# EAGLE design rpifan (EAGLE 9.6.1)
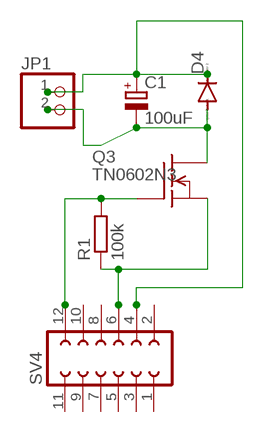
[diagram p0: schematic, sheet 1]

## Parts
C1  100uF  CPOL-EUE2-5  [E2-5]
D4  DIODE-D-2.5  [D-2.5]
JP1  PINHD-1X2  [1X02]
Q3  TN0602N3  [TO-92]
R1  100k  R-EU_0204/7  [0204/7]
SV4  FE06-2  [FE06-2]

## Nets
N$1: Q3.2(G) R1.2 SV4.12
N$2: Q3.1(S) R1.1 SV4.6
N$3: C1.- D4.A JP1.2 Q3.3(D)
N$5: C1.+ D4.C JP1.1 SV4.4
Unconnected: SV4.1 SV4.2 SV4.3 SV4.5 SV4.7 SV4.8 SV4.9 SV4.10 SV4.11

## Library data of the parts
C1 = rcl:CPOL-EU: POLARIZED CAPACITOR, European symbol; SPICEPREFIX: C
D4 = diode:DIODE-: DIODE
JP1 = pinhead:PINHD-1X2: PIN HEADER
Q3 = transistor-fet:TN0602N3: N-Channel Enhancement MOSFET 20V; 4A; 0,75Ohm
R1 = rcl:R-EU_: RESISTOR, European symbol; SPICEPREFIX: R
SV4 = con-lsta:FE06-2: FEMALE HEADER; OC_FARNELL: unknown; OC_NEWARK: unknown

## Board
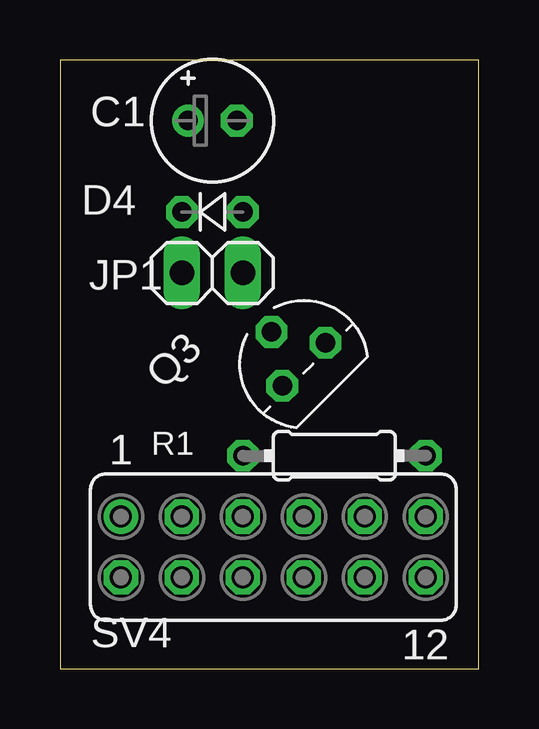
[diagram p1: board, top side]
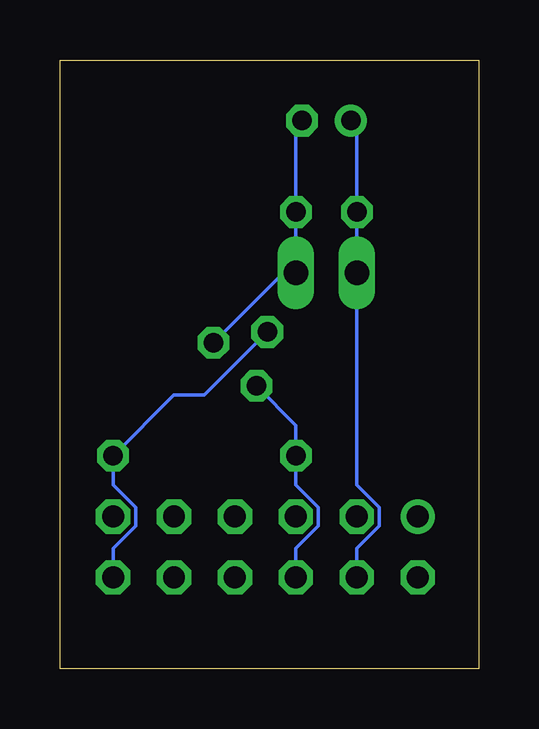
[diagram p2: board, bottom side, seen from below]

Size 17.45 x 25.39 mm. Coordinates in mm from the lower left corner, seen from the top.
Outline: 0,0 17.45,0 17.45,25.39 0,25.39 0,0
Copper layers (1*16): Top 0.035mm / dielectric 1.5mm / Bottom 0.035mm
Design rules "default": minimum track width 6mil, minimum drill 0.35mm, track to track 6mil, track to pad 6mil, pad to pad 6mil, via to via 6mil, smd to smd 6mil, copper to edge 40mil, drill to drill 6mil, minimum pad ring 10mil, minimum via ring 8mil, stop-mask expansion 4mil, vias tented up to drill 0mil, thermal gap 10mil

### Footprints (pad centres in the part's own frame; a part is rotated, then mirrored left to right if it is on the bottom)
E2-5 = drill 0.813 pad 1.27: + -1.016,0 | drill 0.813 pad 1.27 octagon: - 1.016,0
D-2.5 = drill 0.813 octagon: A 1.27,0; C -1.27,0
1X02 = drill 1.016 long: 1 -1.27,0; 2 1.27,0
TO-92 = drill 0.813 octagon: 1 -1.27,0; 2 0,1.905; 3 1.27,0
0204/7 = drill 0.813 octagon: 1 -3.81,0; 2 3.81,0
FE06-2 = drill 0.914: 1 -6.35,1.27 | drill 0.914 octagon: 2 -6.35,-1.27; 3 -3.81,1.27; 4 -3.81,-1.27; 5 -1.27,1.27; 6 -1.27,-1.27; 7 1.27,1.27; 8 1.27,-1.27; 9 3.81,1.27; 10 3.81,-1.27; 11 6.35,1.27; 12 6.35,-1.27

### Placement (x,y rotation side)
C1  6.35,22.86 0 top
D4  6.35,19.05 0 top
JP1  6.35,16.51 0 top
Q3  10.16,12.7 45 top
R1  11.43,8.89 0 top
SV4  8.89,5.08 0 top

### Tracks (layer width: path | path; a pad name or v marks a point on that pad's centre or on a via)
N$1
  Bottom 0.152: SV4.12 15.24,5.02 14.3,5.96 14.3,6.74 15.24,7.68 R1.2 12.7,11.43 11.43,11.43 Q3.2
N$2
  Bottom 0.152: SV4.6 7.62,5.02 6.68,5.96 6.68,6.74 7.62,7.68 R1.1 7.62,10.16 Q3.1
N$3
  Bottom 0.152: Q3.3 8.15,16.51 JP1.2 D4.A 7.62,22.61 C1.-
N$5
  Bottom 0.152: SV4.4 5.08,5.02 4.14,5.96 4.14,6.74 5.08,7.68 JP1.1 D4.C 5.08,22.86 C1.+ 5.08,22.61